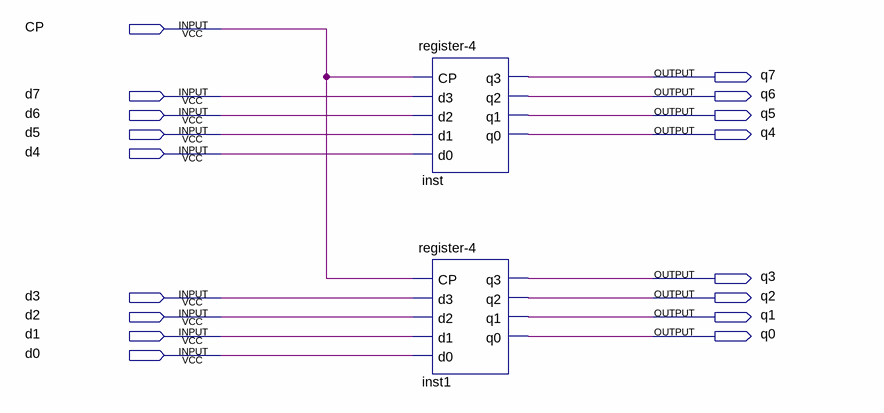
[diagram p0: schematic sheet]
// Quartus schematic register-8.bdf as structural Verilog: 2 symbols, 17 pins
module \register-8  (
  input  CP,
  input  d7,
  input  d6,
  input  d5,
  input  d4,
  input  d3,
  input  d2,
  input  d1,
  input  d0,
  output q7,
  output q6,
  output q5,
  output q4,
  output q3,
  output q2,
  output q1,
  output q0
);

  \register-4  inst (.CP(CP), .d3(d7), .d2(d6), .d1(d5), .d0(d4), .q3(q7), .q2(q6), .q1(q5), .q0(q4));
  \register-4  inst1 (.CP(CP), .d3(d3), .d2(d2), .d1(d1), .d0(d0), .q3(q3), .q2(q2), .q1(q1), .q0(q0));
endmodule
